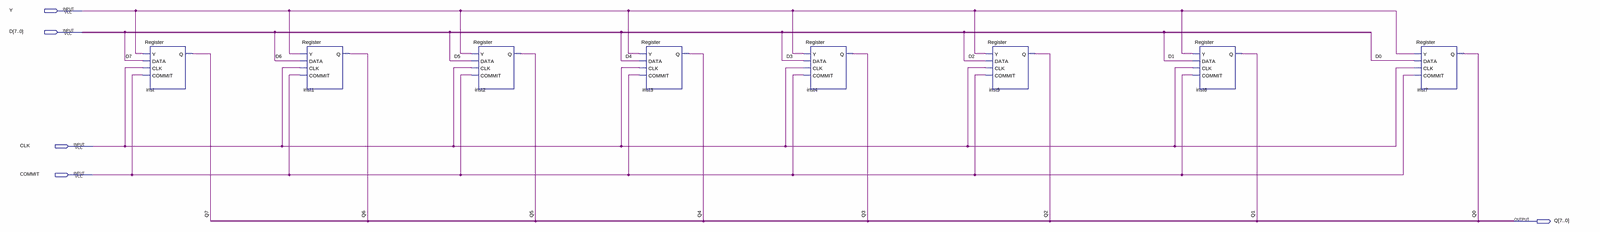
[diagram p0: schematic sheet, whole]
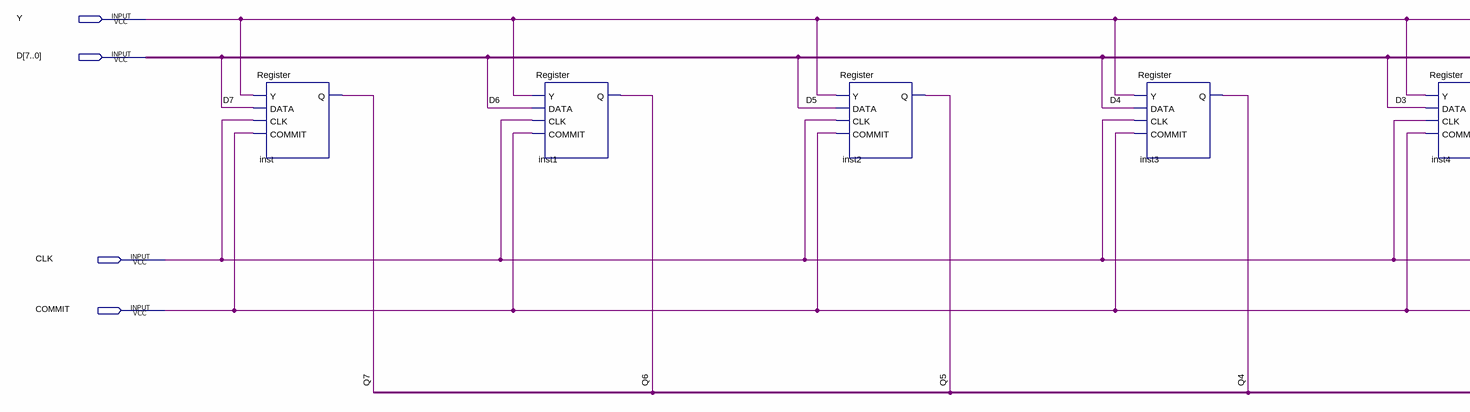
[diagram p1: schematic sheet, left part]
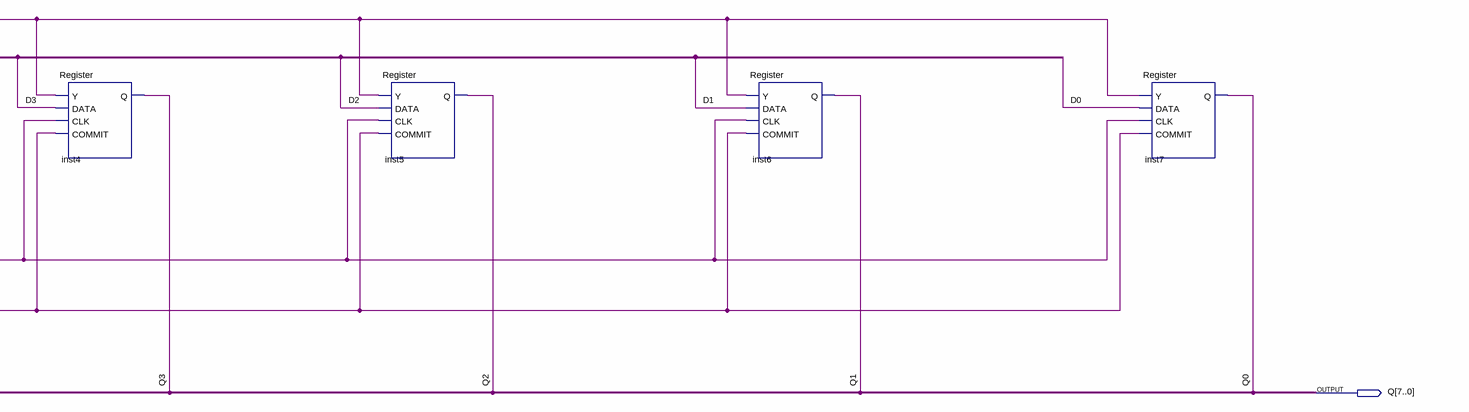
[diagram p2: schematic sheet, right part]
// Quartus schematic reg_8b.bdf as structural Verilog: 8 symbols, 5 pins
module reg_8b (
  input  Y,
  input  [7:0] D,
  input  CLK,
  input  COMMIT,
  output [7:0] Q
);

  Register inst (.Y(Y), .DATA(D[7]), .CLK(CLK), .COMMIT(COMMIT), .Q(Q[7]));
  Register inst1 (.Y(Y), .DATA(D[6]), .CLK(CLK), .COMMIT(COMMIT), .Q(Q[6]));
  Register inst2 (.Y(Y), .DATA(D[5]), .CLK(CLK), .COMMIT(COMMIT), .Q(Q[5]));
  Register inst3 (.Y(Y), .DATA(D[4]), .CLK(CLK), .COMMIT(COMMIT), .Q(Q[4]));
  Register inst4 (.Y(Y), .DATA(D[3]), .CLK(CLK), .COMMIT(COMMIT), .Q(Q[3]));
  Register inst5 (.Y(Y), .DATA(D[2]), .CLK(CLK), .COMMIT(COMMIT), .Q(Q[2]));
  Register inst6 (.Y(Y), .DATA(D[1]), .CLK(CLK), .COMMIT(COMMIT), .Q(Q[1]));
  Register inst7 (.Y(Y), .DATA(D[0]), .CLK(CLK), .COMMIT(COMMIT), .Q(Q[0]));
endmodule
